# EAGLE design Yitran_IT900_Hutschiene_1_3 (EAGLE 6.1)
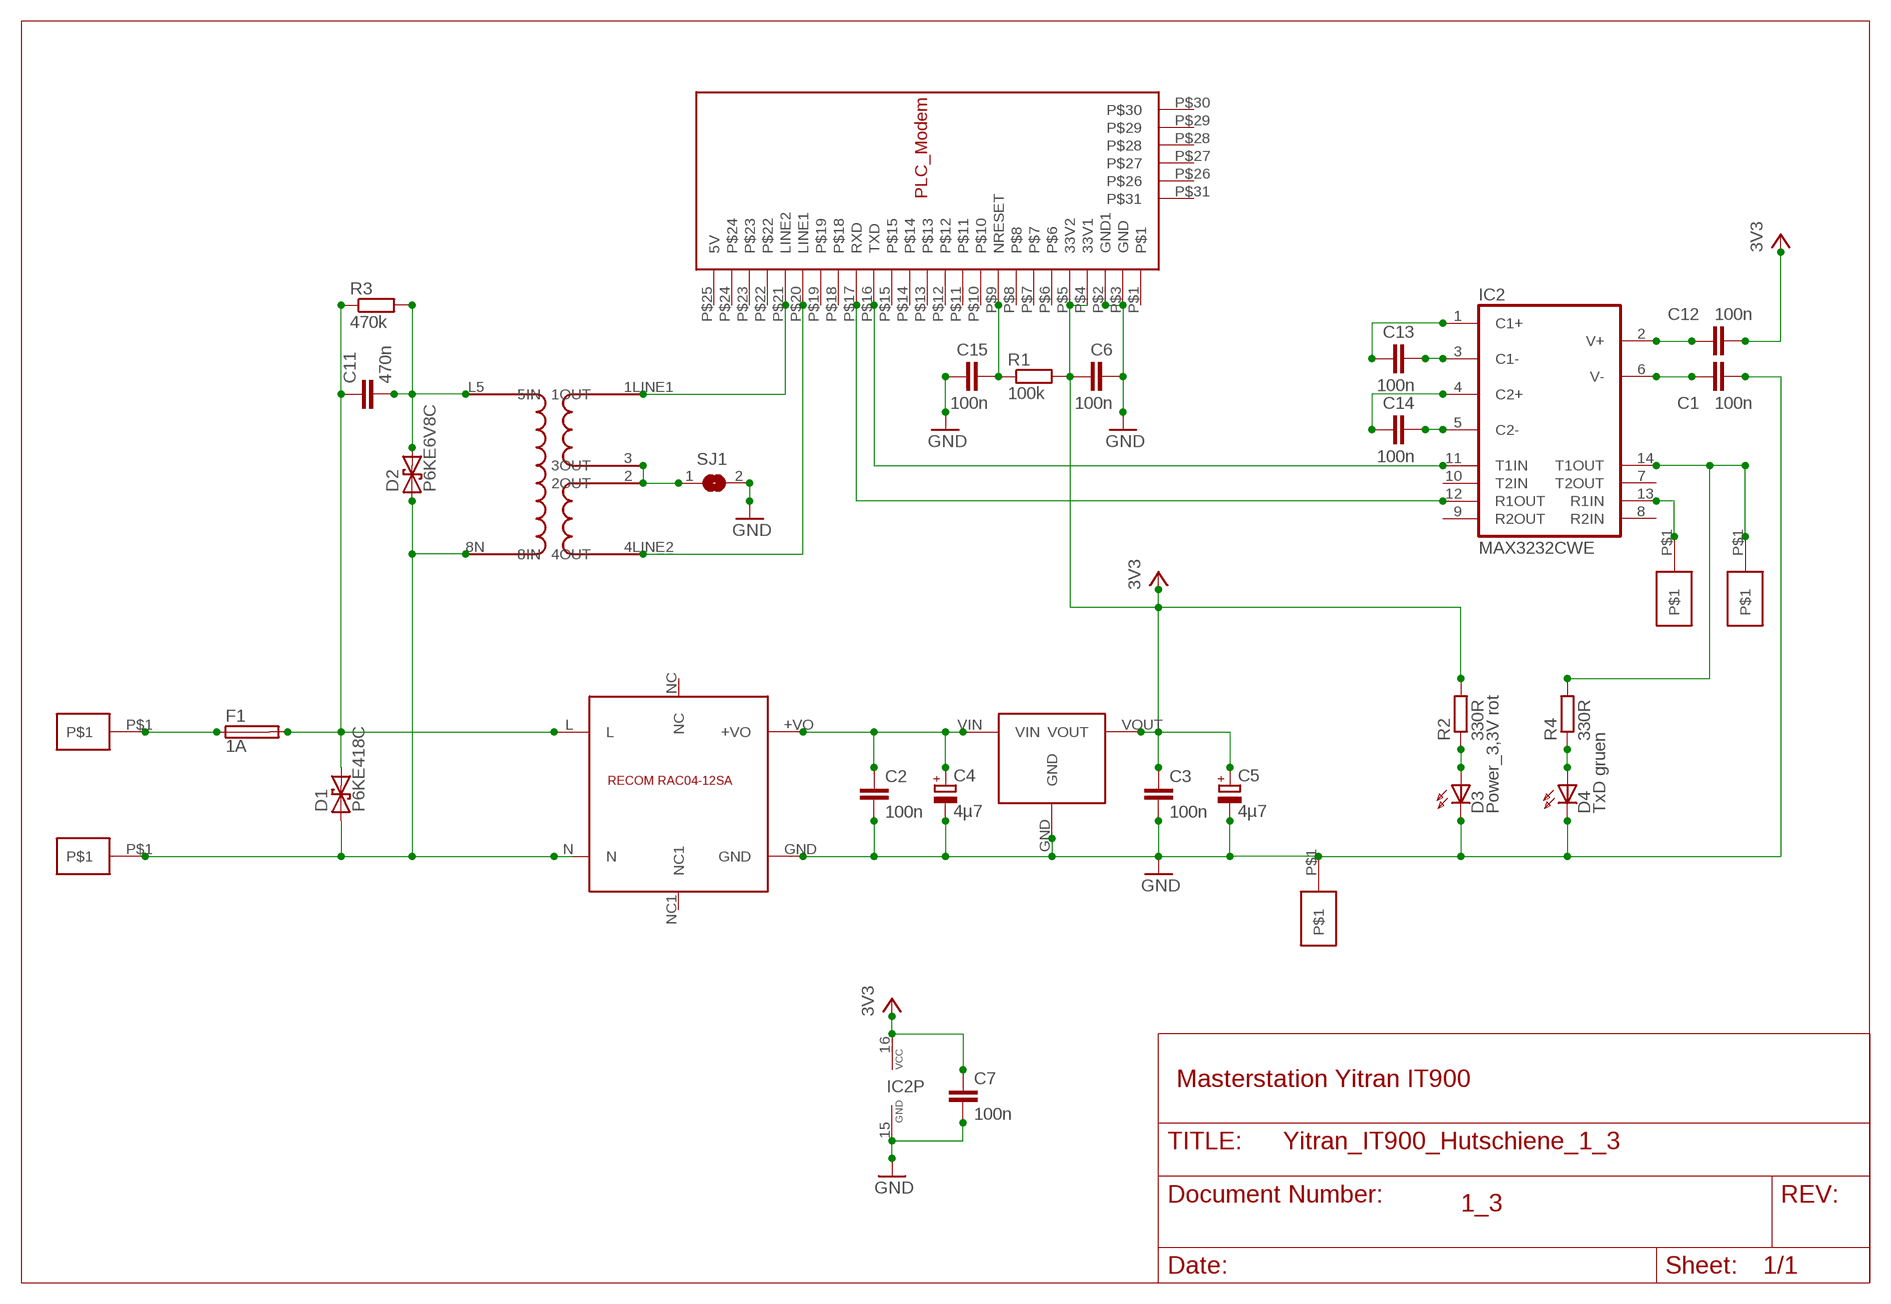
[diagram p0: schematic, sheet 1]

## Parts
C1  100n  C-EUC1206K  [C1206K]
C2  100n  C-EUC1206K  [C1206K]
C3  100n  C-EUC1206K  [C1206K]
C4  4µ7  CPOL-EUE2.5-5  [E2,5-5]
C5  4µ7  CPOL-EUE2.5-5  [E2,5-5]
C6  100n  C-EUC1206K  [C1206K]
C7  100n  C-EUC1206K  [C1206K]
C11  470n  C-EU150-091X182  [C150-091X182]
C12  100n  C-EUC1206K  [C1206K]
C13  100n  C-EUC1206K  [C1206K]
C14  100n  C-EUC1206K  [C1206K]
C15  100n  C-EUC1206K  [C1206K]
D1  P6KE418C  P6KEXXC  [CB417-15]
D2  P6KE6V8C  P6KEXXC  [CB417-15]
D3  Power_3,3V rot  HLMP6  [HLMP6]
D4  TxD gruen  HLMP6  [HLMP6]
F1  1A  TR5  [TR5]
GND  PN4  [PIN2]
IC2  MAX3232CWE  [SO16L]
PL1  PN4  [PIN2]
PL2  PN4  [PIN2]
R1  100k  R-EU_M1406  [M1406]
R2  330R  R-EU_R1206  [R1206]
R3  470k  R-EU_0309/10  [0309/10]
R4  330R  R-EU_R1206  [R1206]
RXD  PN4  [PIN2]
SJ1  SJW  [SJW]
TXD  PN4  [PIN2]
U$1  RECOM_783_3  RECOM_785_05  [RECOM785X]
U$3  MODEMSTECKER  [MODEM_FUSS]
U$9  RECOM_RAC04_12SA  [RAC04_12SA]
U$10  PLC_UEBERTRAGER_V2  [PLC-UEBERTRAGER_V2]

## Nets
3V3: C3.1 C5.+ C6.1 C7.1 C12.2 IC2.16(VCC) R1.2 R2.2 U$1.VOUT U$3.P$4(33V1) U$3.P$5(33V2)
GND: C1.2 C2.2 C3.2 C4.- C5.- C6.2 C7.2 C15.1 D3.K D4.K GND.P$1 IC2.15(GND) SJ1.2 U$1.GND U$3.P$2(GND1) U$3.P$3(GND) U$9.GND
L: C11.1 D1.C F1.2 R3.1 U$9.L
N: D1.A D2.A PL2.P$1 U$9.N U$10.8N(8IN)
N$1: F1.1 PL1.P$1
N$2: C11.2 D2.C R3.2 U$10.L5(5IN)
N$3: C2.1 C4.+ U$1.VIN U$9.+VO
N$4: D3.A R2.1
N$5: U$3.P$21(LINE2) U$10.1LINE1(1OUT)
N$6: U$3.P$20(LINE1) U$10.4LINE2(4OUT)
N$7: C13.1 IC2.1(C1+)
N$8: C13.2 IC2.3(C1-)
N$9: C14.1 IC2.4(C2+)
N$10: C14.2 IC2.5(C2-)
N$11: C12.1 IC2.2(V+)
N$12: C1.1 IC2.6(V-)
N$13: D4.A R4.1
N$14: SJ1.1 U$10.2(2OUT) U$10.3(3OUT)
N$16: IC2.11(T1IN) U$3.P$16(TXD)
N$18: IC2.12(R1OUT) U$3.P$17(RXD)
N$19: C15.2 R1.1 U$3.P$9(NRESET)
RXD: IC2.13(R1IN) RXD.P$1
TXD: IC2.14(T1OUT) R4.2 TXD.P$1
Unconnected: IC2.7(T2OUT) IC2.8(R2IN) IC2.9(R2OUT) IC2.10(T2IN) U$3.P$1 U$3.P$6 U$3.P$7 U$3.P$8 U$3.P$10 U$3.P$11 U$3.P$12 U$3.P$13 U$3.P$14 U$3.P$15 U$3.P$18 U$3.P$19 U$3.P$22 U$3.P$23 U$3.P$24 U$3.P$25(5V) U$3.P$26 U$3.P$27 U$3.P$28 U$3.P$29 U$3.P$30 U$3.P$31 U$9.NC U$9.NC1

## Notes on the sheet
- Masterstation Yitran IT900
- 1_3

## Library data of the parts
C1-C3 C6 C7 C11-C15 = resistor:C-EU: CAPACITOR, European symbol
C4 C5 = resistor:CPOL-EU: POLARIZED CAPACITOR, European symbol
D1 D2 = diode:P6KEXXC: DIODE transient-voltage suppressor
D3 D4 = display-hp:HLMP6: LED 2mm horizontal; MF: AGILENT TECHNOLOGIES; MPN: HLMP-6500; OC_FARNELL: 1652490; OC_NEWARK: 40K0088
F1 = fuse:TR5: FUSE Wickmann; OC_FARNELL: unknown; OC_NEWARK: unknown
GND PL1 PL2 RXD TXD = Strommessung:PN4
IC2 = maxim:MAX3232*: True RS-232 Transceivers 3.0V to 5.5V, Low-Power up to 1Mbps, Using Four 0.1µF External Capacitors Source: http://pdfserv.maxim-ic.com/en/ds/MAX3222-MAX3241.pdf; MF: MAXIM; MPN: MAX3232CWE+; OC_FARNELL: 9725504; OC_NEWARK: 68K4630
R1-R4 = resistor:R-EU_: RESISTOR, European symbol
SJ1 = jumper:SJ: SMD solder JUMPER
U$1 = ADS:RECOM_785_05
U$3 = ADS:MODEMSTECKER
U$9 = ADS:RECOM_RAC04_12SA
U$10 = ADS:PLC_UEBERTRAGER_V2

## Board
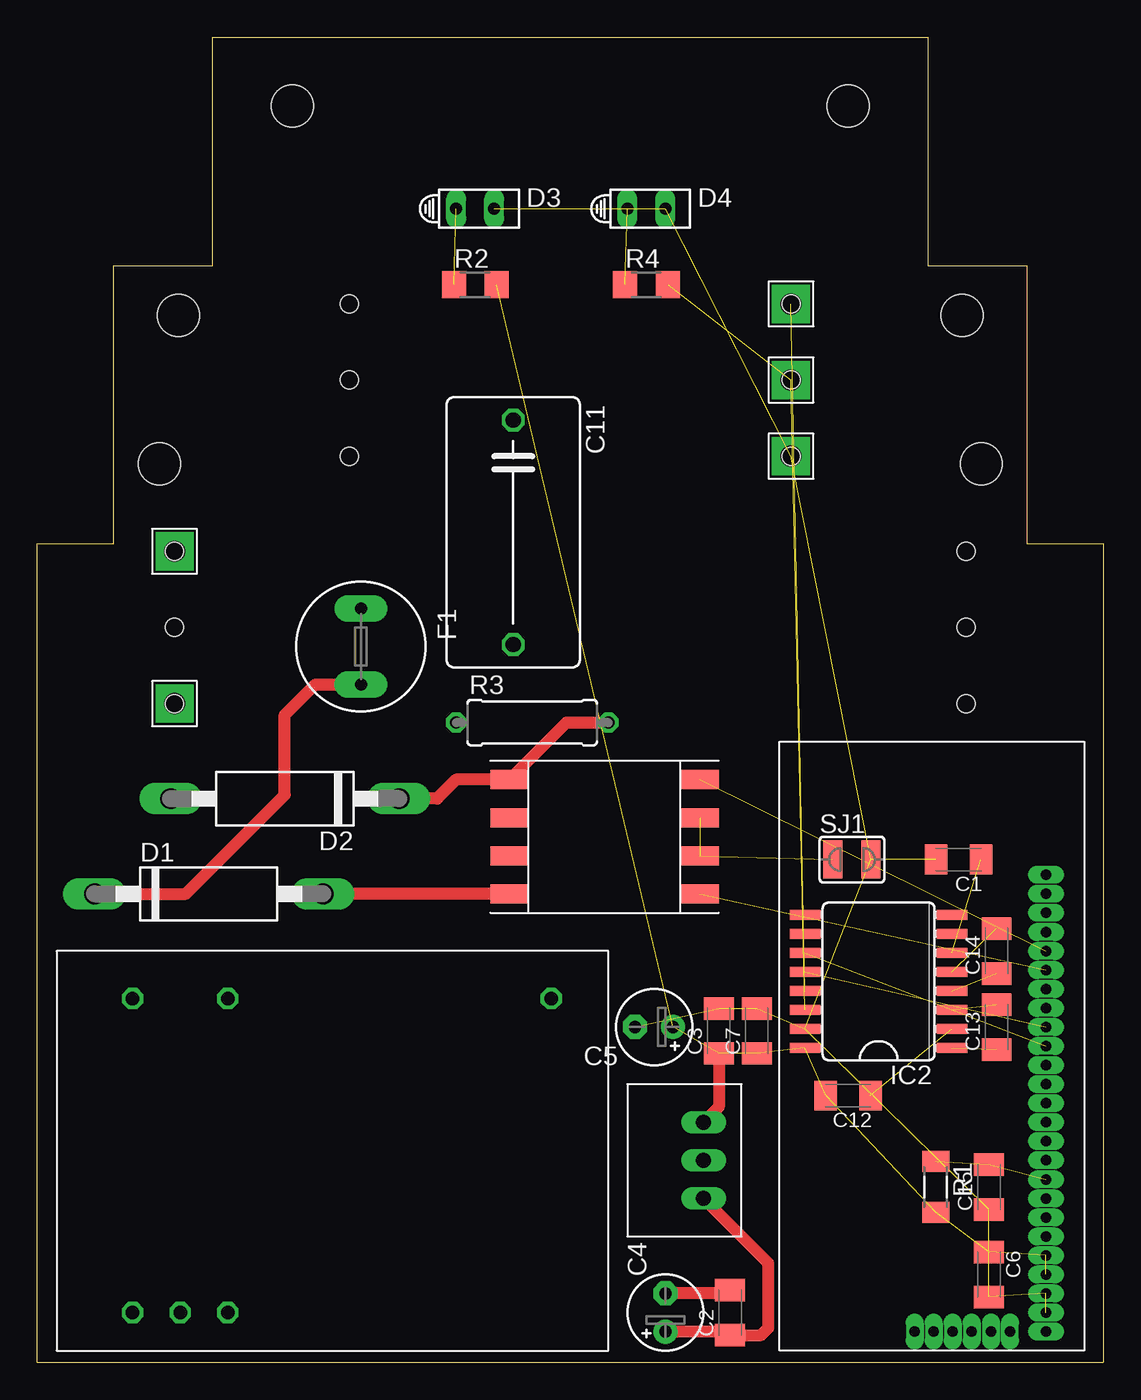
[diagram p1: board, top side]
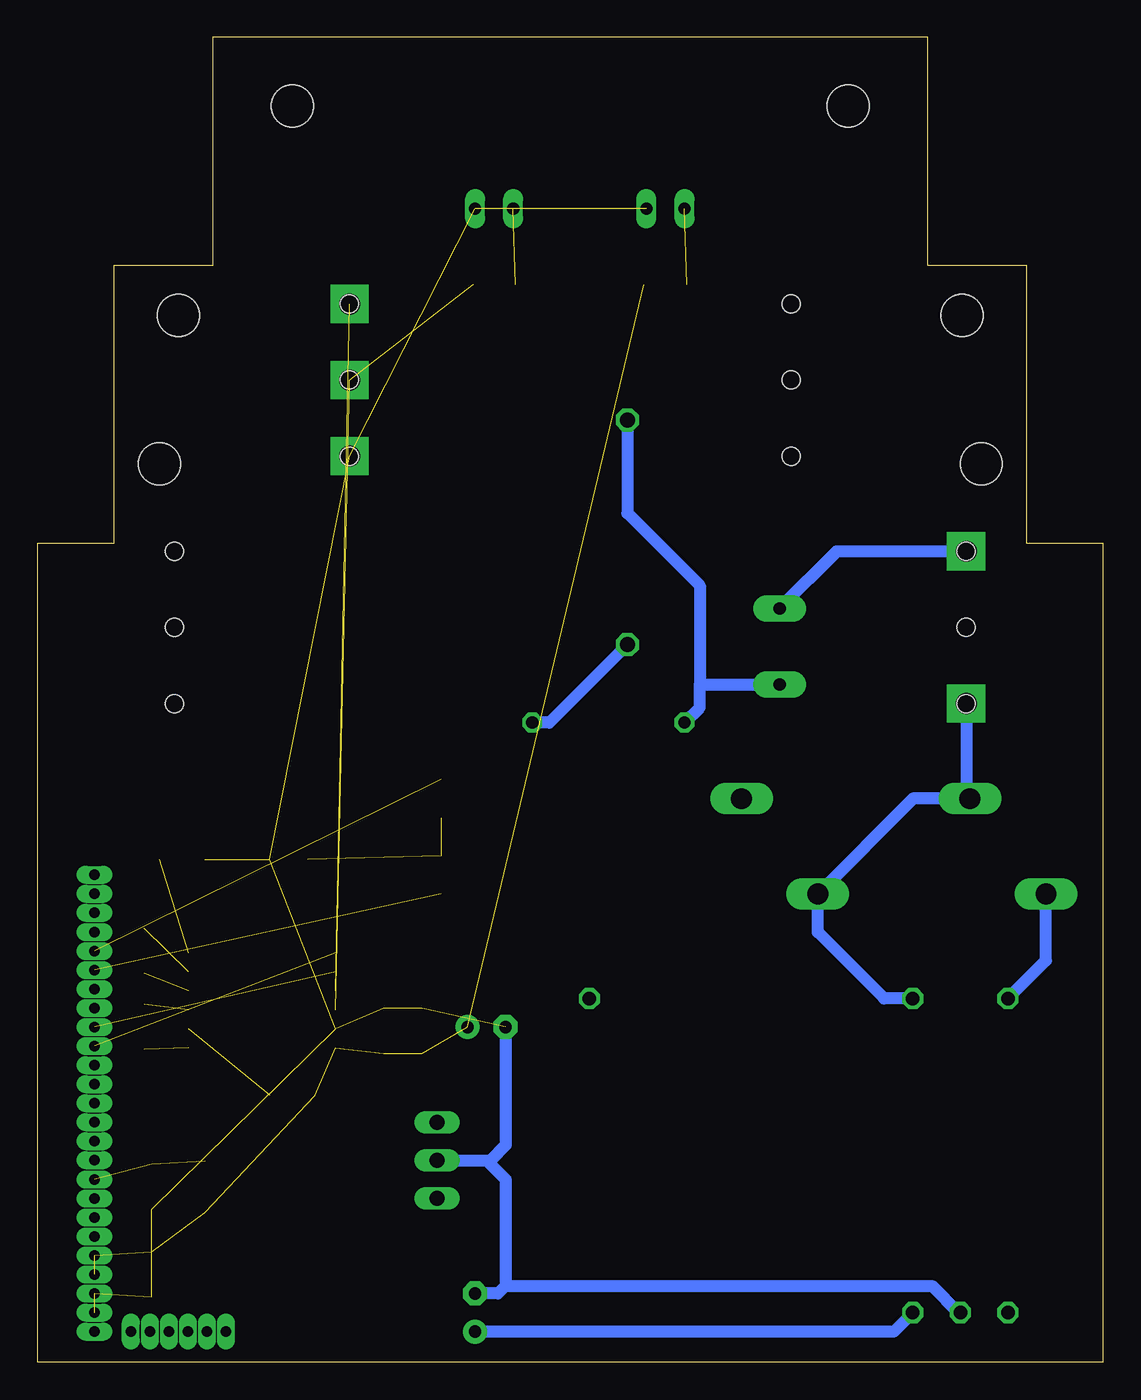
[diagram p2: board, bottom side, seen from below]

Size 71.12 x 88.39 mm. Coordinates in mm from the lower left corner, seen from the top.
Copper layers (1*16): Top 0.035mm / dielectric 1.5mm / Bottom 0.035mm
Design rules: minimum track width 10mil, minimum drill 24mil, track to track 8mil, track to pad 8mil, pad to pad 8mil, via to via 8mil, smd to smd 8mil, copper to edge 40mil, drill to drill 8mil, minimum pad ring 10mil, minimum via ring 8mil, stop-mask expansion 4mil, vias tented up to drill 0mil, thermal gap 10mil

### Footprints (pad centres in the part's own frame; a part is rotated, then mirrored left to right if it is on the bottom)
C1206K = smd 1.5 x 2: 1 -1.5,0; 2 1.5,0
E2,5-5 = drill 0.813 pad 1.6: + -1.27,0 | drill 0.813 pad 1.6 octagon: - 1.27,0
C150-091X182 = drill 1.016 octagon: 1 -7.493,0; 2 7.493,0
CB417-15 = drill 1.397 long: A 7.62,0; C -7.62,0
HLMP6 = drill 0.813 long: A -1.27,0; K 1.27,0
TR5 = drill 0.813 pad 1.778 long: 1 -2.54,0; 2 2.54,0
PIN2 = drill 1.4 pad 2.54 square: P$1 0,0
SO16L = smd 0.66 x 2.032: 1 -4.445,-4.902; 2 -3.175,-4.902; 3 -1.905,-4.902; 4 -0.635,-4.902; 5 0.635,-4.902; 6 1.905,-4.902; 7 3.175,-4.902; 8 4.445,-4.902; 9 4.445,4.902; 10 3.175,4.902; 11 1.905,4.902; 12 0.635,4.902; 13 -0.635,4.902; 14 -1.905,4.902; 15 -3.175,4.902; 16 -4.445,4.902
M1406 = smd 1.4 x 1.8: 1 -1.7,0; 2 1.7,0
R1206 = smd 1.6 x 1.803: 1 -1.422,0; 2 1.422,0
0309/10 = drill 0.813 octagon: 1 -5.08,0; 2 5.08,0
SJW = smd 1.27 x 2.54: 1 -1.27,0; 2 1.27,0
RECOM785X = drill 1 long: GND 0,2.54; VIN -2.54,2.54; VOUT 2.54,2.54
LDG-A-12 = hole 2.8: -18.542,-4.572; 18.542,-4.572; 26.162,-18.542; -26.162,-18.542; -27.432,-28.448; 27.432,-28.448 | hole 1.2: 14.732,-27.94; 14.732,-22.86; 14.732,-17.78; -14.732,-27.94; -14.732,-22.86; -14.732,-17.78; -26.416,-34.29; -26.416,-39.37; -26.416,-44.45; 26.416,-44.45; 26.416,-39.37; 26.416,-34.29
MODEM_FUSS = drill 0.7 pad 0.813 long: P$1 -20.32,-8.89; P$2 -19.05,-8.89; P$3 -17.78,-8.89; P$4 -16.51,-8.89; P$5 -15.24,-8.89; P$6 -13.97,-8.89; P$7 -12.7,-8.89; P$8 -11.43,-8.89; P$9 -10.16,-8.89; P$10 -8.89,-8.89; P$11 -7.62,-8.89; P$12 -6.35,-8.89; P$13 -5.08,-8.89; P$14 -3.81,-8.89; P$15 -2.54,-8.89; P$16 -1.27,-8.89; P$17 0,-8.89; P$18 1.27,-8.89; P$19 2.54,-8.89; P$20 3.81,-8.89; P$21 5.08,-8.89; P$22 6.35,-8.89; P$23 7.62,-8.89; P$24 8.89,-8.89; P$25 10.16,-8.89; P$29 -20.32,-3.937; P$30 -20.32,-5.207; P$31 -20.32,-6.477 | drill 0.7 pad 0.61 long: P$26 -20.32,-0.127; P$27 -20.32,-1.397; P$28 -20.32,-2.667
RAC04_12SA = drill 0.9 octagon: +VO 25.4,24.13; GND 28.575,24.13; L 31.75,3.175; N 25.4,3.175; NC 3.81,3.175; NC1 31.75,24.13
PLC-UEBERTRAGER_V2 = smd 2.54 x 1.27: 1LINE1 6.35,3.81; 2 6.35,1.27; 3 6.35,-1.27; 4LINE2 6.35,-3.81; 6NC -6.35,1.27; 7NC -6.35,-1.27; 8N -6.35,-3.81; L5 -6.35,3.81

### Placement (x,y rotation side)
C1  61.47,33.53 180 top
C2  46.23,3.3 90 top
C3  45.47,22.1 90 top
C4  41.91,3.3 90 top
C5  41.15,22.35 180 top
C6  63.5,5.84 270 top
C7  48.01,22.1 90 top
C11  31.75,55.37 270 top
C12  54.1,17.78 180 top
C13  64.01,22.35 90 top
C14  64.01,27.43 90 top
C15  63.5,11.68 90 top
D1  11.43,31.24 0 top
D2  16.51,37.59 180 top
D3  29.21,76.96 0 top
D4  40.64,76.96 0 top
F1  21.59,47.75 270 top
GND  50.29,60.45 0 top
IC2  56.13,25.4 90 top
PL1  9.14,54.1 0 top
PL2  9.14,43.94 0 top
R1  59.94,11.68 270 top
R2  29.21,71.88 0 top
R3  33.02,42.67 0 top
R4  40.64,71.88 0 top
RXD  50.29,70.61 0 top
SJ1  54.36,33.53 0 top
TXD  50.29,65.53 0 top
U$1  46.99,13.46 90 top
U$2  [LDG-A-12]  35.56,88.39 0 top
U$3  58.42,22.35 90 top
U$9  38.1,27.43 180 top
U$10  37.85,35.05 0 top

### Tracks (layer width: path | path; a pad name or v marks a point on that pad's centre or on a via)
3V3  (9 unrouted)
  Top 0.813: C3.1 45.47,17.02 U$1.VOUT
GND  (12 unrouted)
  Top 0.813: C2.2 46,4.57 C4.-
  Bottom 0.813: U$1.GND 40.89,13.46 | C5.- 39.88,14.48 40.89,13.46 | 40.89,13.46 40.89,13.21 39.88,12.19 39.88,5.08 | 39.88,5.08 40.39,4.57 C4.- | 39.88,5.08 11.43,5.08 9.65,3.3 U$9.GND
L
  Top 0.813: D1.C 9.91,31.24 16.51,37.85 16.51,43.18 18.54,45.21 F1.2
  Bottom 0.813: U$9.L 3.81,26.8 D1.C | C11.1 31.75,56.64 26.92,51.82 26.92,45.21 | 26.92,45.21 F1.2 | R3.1 26.92,43.69 26.92,45.21
N
  Top 0.813: U$10.8N D1.A
  Bottom 0.813: PL2.P$1 9.14,37.85 D2.A 12.7,37.59 D1.A 19.05,28.7 14.61,24.26 U$9.N
N$1
  Bottom 0.813: PL1.P$1 17.78,54.1 F1.1
N$2
  Top 0.813: R3.2 35.31,42.67 U$10.L5 27.94,38.86 26.67,37.59 D2.C
  Bottom 0.813: C11.2 36.96,42.67 R3.2
N$3
  Top 0.813: C4.+ 46,2.03 C2.1 48.28,1.8 48.77,2.29 48.77,6.6 U$1.VIN
  Bottom 0.813: U$9.+VO 13.97,2.03 C4.+
N$4  (1 unrouted)
N$5  (1 unrouted)
N$6  (1 unrouted)
N$7  (1 unrouted)
N$8  (1 unrouted)
N$9  (1 unrouted)
N$10  (1 unrouted)
N$11  (1 unrouted)
N$12  (1 unrouted)
N$13  (1 unrouted)
N$14  (2 unrouted)
N$16  (1 unrouted)
N$18  (1 unrouted)
N$19  (2 unrouted)
RXD  (1 unrouted)
TXD  (2 unrouted)